# EAGLE design BT_magnetic_switch (EAGLE 7.7.0)
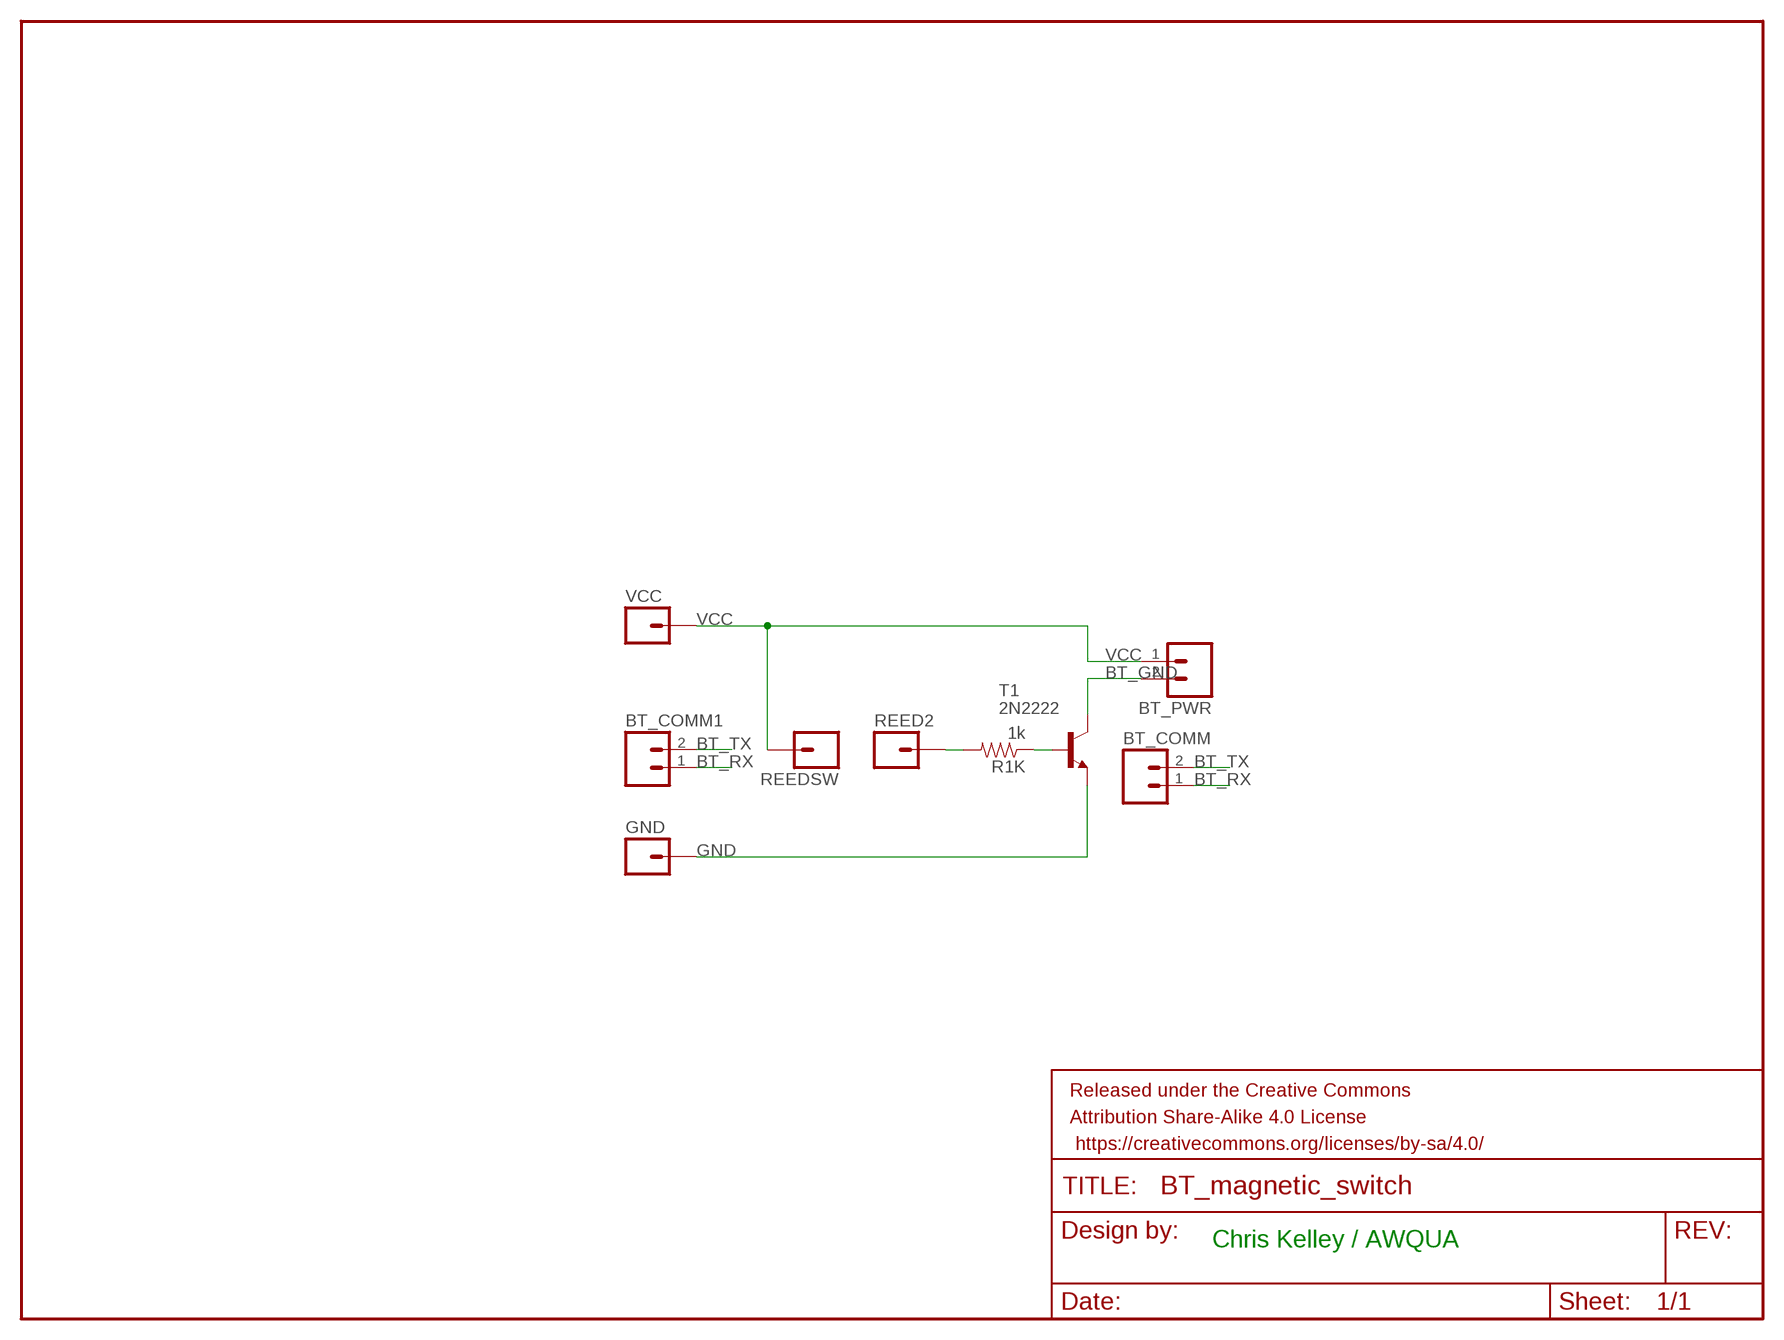
[diagram p0: schematic, sheet 1]

## Parts
BT_COMM  M02PTH  [1X02]
BT_COMM1  M02PTH  [1X02]
BT_PWR  M02PTH  [1X02]
FRAME1  FRAME-LETTER  [CREATIVE_COMMONS]
GND  M01PTH  [1X01]
R1K  1k  RESISTOR0603-RES  [0603-RES]
REED2  M01PTH  [1X01]
REEDSW  M01PTH  [1X01]
T1  2N2222  [TO92-EBC-OVAL]
VCC  M01PTH  [1X01]

## Nets
BT_GND: BT_PWR.2 T1.C
BT_RX: BT_COMM1.1 BT_COMM.1
BT_TX: BT_COMM1.2 BT_COMM.2
GND: GND.1 T1.E
N$10: R1K.1 T1.B
N$11: R1K.2 REED2.1
VCC: BT_PWR.1 REEDSW.1 VCC.1

## Notes on the sheet
- Chris Kelley / AWQUA

## Library data of the parts
BT_COMM BT_COMM1 BT_PWR = SparkFun-Connectors:M02: Standard 2-pin 0.1" header. Use with - straight break away headers ( PRT-00116) - right angle break away headers (PRT-00553) - swiss pins (PRT-00743) - machine pins (PRT-00117) - female headers (PRT-00115) Molex polarized connector foot print use with: PRT-08233 with associated crimp pins and housings. 2.54_SCREWTERM for use with PRT-10571. 3.5mm Screw Terminal footprints for PRT-08084 5mm Screw Terminal footprints for use with PRT-08432
FRAME1 = SparkFun-Aesthetics:FRAME-LETTER: Schematic Frame Standard 8.5x11 US Letter frame
GND REED2 REEDSW VCC = SparkFun-Connectors:M01: Header 1 Standard 1-pin 0.1" header. Use with straight break away headers (SKU : PRT-00116), right angle break away headers (PRT-00553), swiss pins (PRT-00743), machine pins (PRT-00117), and female headers (PRT-00115).
R1K = SparkFun-Passives:RESISTOR: Resistor Basic schematic elements and footprints for 0603, 1206, and PTH resistors.
T1 = adafruit:2N2222: NPN TRANSISTOR Big oval pads

## Board
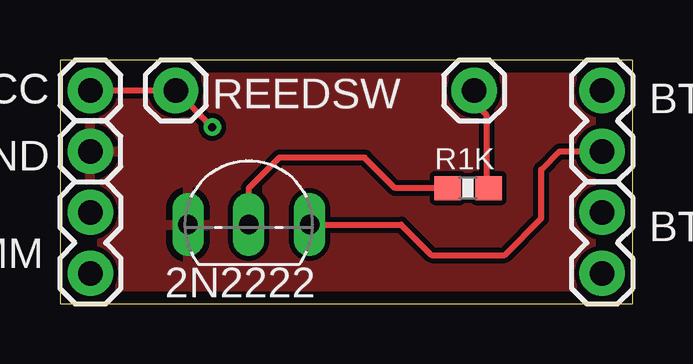
[diagram p1: board, top side]
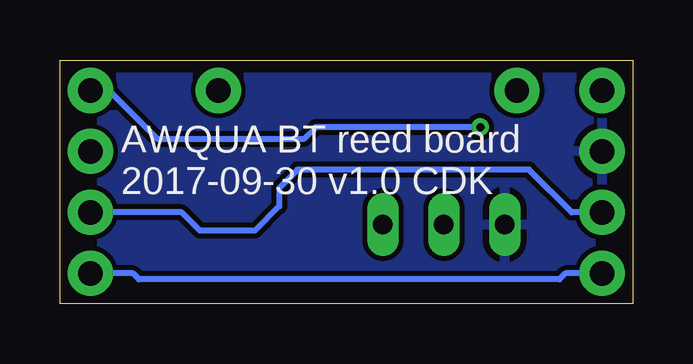
[diagram p2: board, bottom side, seen from below]

Size 23.88 x 10.16 mm. Coordinates in mm from the lower left corner, seen from the top.
Outline: 0,10.16 0,0 23.88,0 23.88,10.16 0,10.16
Copper layers (1*16): Top 0.035mm / dielectric 1.5mm / Bottom 0.035mm
Design rules "default *": minimum track width 8mil, minimum drill 12mil, track to track 8mil, track to pad 8mil, pad to pad 8mil, via to via 8mil, smd to smd 8mil, copper to edge 20mil, drill to drill 8mil, minimum pad ring 10mil, minimum via ring 8mil, stop-mask expansion 2mil, vias tented up to drill 13mil, thermal gap 10mil

### Footprints (pad centres in the part's own frame; a part is rotated, then mirrored left to right if it is on the bottom)
1X02 = drill 1.016 pad 1.88: 1 0,0; 2 2.54,0
1X01 = drill 1.016 pad 1.88: 1 0,0
0603-RES = smd 1.1 x 1: 1 -0.85,0; 2 0.85,0
TO92-EBC-OVAL = drill 0.813 long: B 0,-1.27; C 2.54,-1.27; E -2.54,-1.27

### Placement (x,y rotation side)
BT_COMM  1.27,1.27 90 top
BT_COMM1  22.61,1.27 90 top
BT_PWR  22.61,8.89 270 top
FRAME1  -8.13,-10.67 0 top  (outside the outline)
GND  1.27,6.35 0 top
R1K  17.02,4.83 0 top
REED2  17.27,8.89 0 top
REEDSW  4.83,8.89 0 top
T1  7.87,4.57 0 top
VCC  1.27,8.89 0 top

### Tracks (layer width: path | path; a pad name or v marks a point on that pad's centre or on a via)
BT_GND
  Top 0.254: T1.C 14.22,3.3 15.49,2.03 18.54,2.03 20.07,3.56 20.07,5.59 20.83,6.35 BT_PWR.2
BT_RX
  Bottom 0.254: BT_COMM.1 2.79,1.27 3.05,1.02 20.57,1.02 20.83,1.27 BT_COMM1.1
BT_TX
  Bottom 0.254: BT_COMM.2 2.54,3.81 4.32,5.59 13.97,5.59 14.73,4.83 14.73,4.06 15.75,3.05 18.03,3.05 18.8,3.81 BT_COMM1.2
GND
  pour Bottom: -5.33,42.16 71.37,43.69 70.61,-2.29 -5.84,-3.3
  pour Top: -4.06,40.89 72.39,41.91 71.88,-3.56 -4.57,-4.57
N$10
  Top 0.254: R1K.1 13.97,4.83 12.7,6.1 9.14,6.1 7.87,4.83 T1.B
N$11
  Top 0.254: REED2.1 17.27,8.38 17.78,7.87 17.78,4.91 R1K.2
VCC  (via drill 0.33)
  Top 0.254: VCC.1 REEDSW.1 v6.35,7.37
  Bottom 0.254: v6.35,7.37 13.21,7.37 13.72,6.86 19.81,6.86 21.84,8.89 BT_PWR.1

### Text on the board
tPlace: Chris Kelley / AWQUA
bPlace: AWQUA BT reed board / 2017-09-30 v1.0 CDK